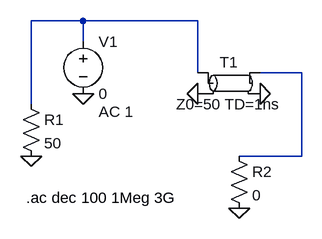
[diagram p0: schematic Project.asc]
Project.asc, the LTspice schematic file:
Version 4.1
SHEET 1 880 680
WIRE 128 16 48 16
WIRE 304 16 128 16
WIRE 128 48 128 16
WIRE 304 96 304 16
WIRE 464 96 400 96
WIRE 48 144 48 16
WIRE 464 224 464 96
WIRE 464 224 368 224
FLAG 128 128 0
FLAG 48 224 0
FLAG 304 128 0
FLAG 400 128 0
FLAG 368 304 0
SYMBOL voltage 128 32 R0
WINDOW 123 24 124 Left 2
WINDOW 39 0 0 Left 0
SYMATTR InstName V1
SYMATTR Value 0
SYMATTR Value2 AC 1
SYMBOL res 32 128 R0
SYMATTR InstName R1
SYMATTR Value 50
SYMBOL tline 352 112 R0
SYMATTR InstName T1
SYMATTR Value Z0=50 TD=1ns
SYMBOL res 352 208 R0
SYMATTR InstName R2
SYMATTR Value 0
TEXT 40 288 Left 2 !.ac dec 100 1Meg 3G

The netlist it stands for:
* Project.asc
V1 N001 0 0 AC 1
R1 N001 0 50
T1 N001 0 N002 0 Z0=50 TD=1ns
R2 N002 0 0
.ac dec 100 1Meg 3G
.backanno
.end